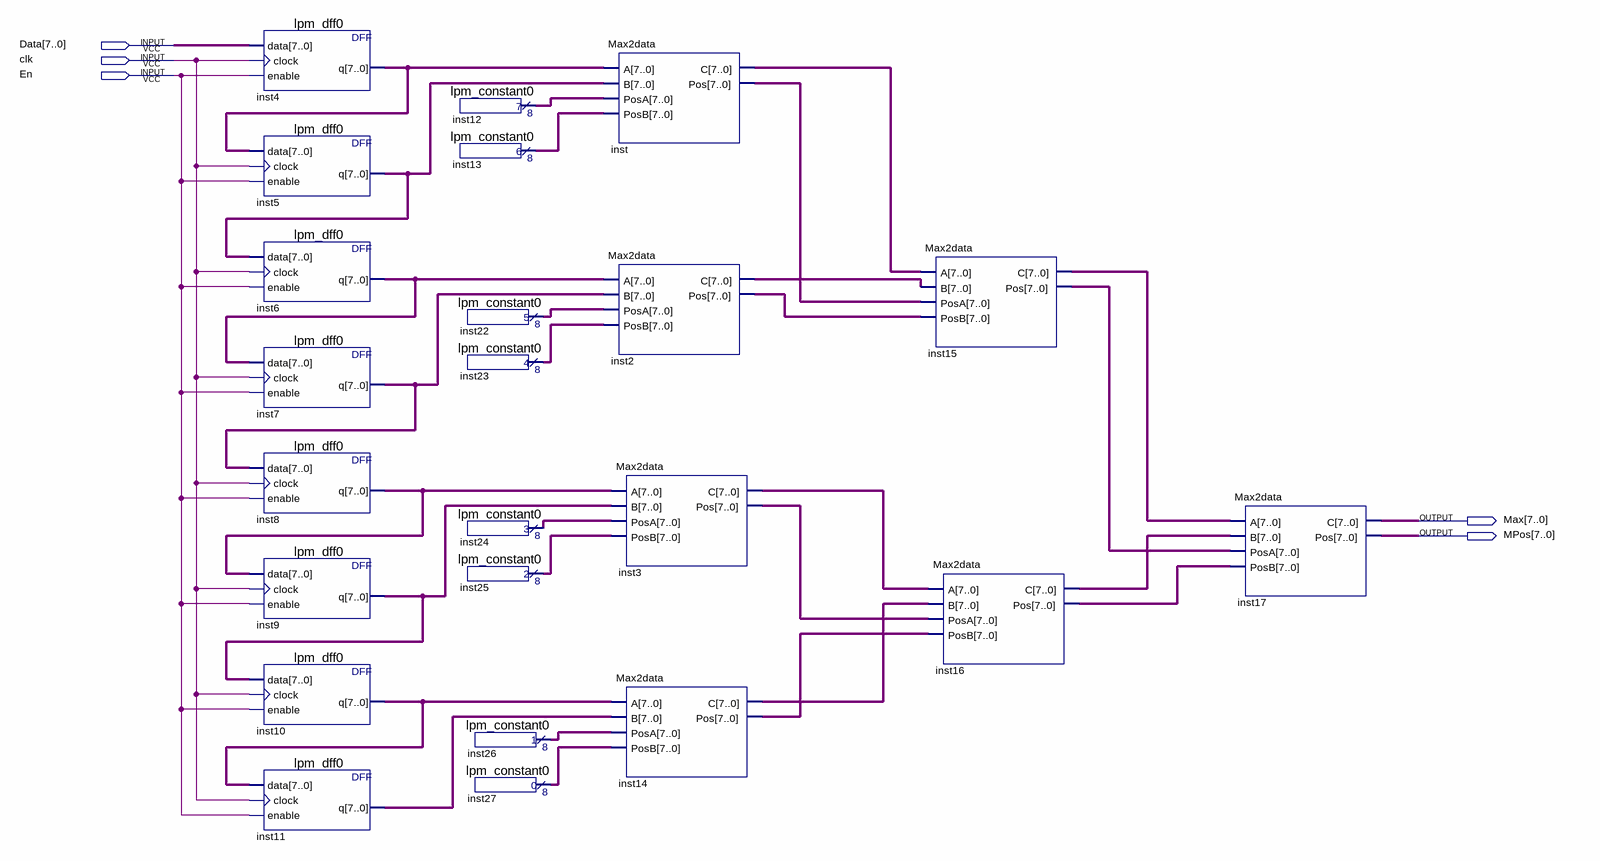
[diagram p0: schematic sheet]
// Quartus schematic 8bit_compare_plus.bdf as structural Verilog: 23 symbols, 5 pins
module \8bit_compare_plus  (
  input  [7:0] Data,
  input  clk,
  input  En,
  output [7:0] Max,
  output [7:0] MPos
);

  wire [7:0] inst2_c, inst2_pos, inst3_c, inst3_pos, inst4_q, inst5_q, inst6_q, inst7_q, inst8_q, inst9_q,
       inst10_q, inst11_q, inst12_result, inst13_result, inst14_c, inst14_pos, inst15_c, inst15_pos,
       inst16_c, inst16_pos, inst22_result, inst23_result, inst24_result, inst25_result, inst26_result,
       inst27_result, inst_c, inst_pos;

  lpm_dff0 inst4 (.data(Data), .clock(clk), .enable(En), .q(inst4_q));
  lpm_dff0 inst5 (.data(inst4_q), .clock(clk), .enable(En), .q(inst5_q));
  lpm_dff0 inst6 (.data(inst5_q), .clock(clk), .enable(En), .q(inst6_q));
  lpm_dff0 inst7 (.data(inst6_q), .clock(clk), .enable(En), .q(inst7_q));
  lpm_dff0 inst8 (.data(inst7_q), .clock(clk), .enable(En), .q(inst8_q));
  lpm_dff0 inst9 (.data(inst8_q), .clock(clk), .enable(En), .q(inst9_q));
  lpm_dff0 inst10 (.data(inst9_q), .clock(clk), .enable(En), .q(inst10_q));
  lpm_dff0 inst11 (.data(inst10_q), .clock(clk), .enable(En), .q(inst11_q));
  lpm_constant0 inst12 (.result(inst12_result));
  lpm_constant0 inst13 (.result(inst13_result));
  lpm_constant0 inst22 (.result(inst22_result));
  lpm_constant0 inst23 (.result(inst23_result));
  lpm_constant0 inst24 (.result(inst24_result));
  lpm_constant0 inst25 (.result(inst25_result));
  lpm_constant0 inst26 (.result(inst26_result));
  lpm_constant0 inst27 (.result(inst27_result));
  Max2data inst (.A(inst4_q), .B(inst5_q), .PosA(inst12_result), .PosB(inst13_result), .C(inst_c), .Pos(inst_pos));
  Max2data inst2 (.A(inst6_q), .B(inst7_q), .PosA(inst22_result), .PosB(inst23_result), .C(inst2_c), .Pos(inst2_pos));
  Max2data inst3 (.A(inst8_q), .B(inst9_q), .PosA(inst24_result), .PosB(inst25_result), .C(inst3_c), .Pos(inst3_pos));
  Max2data inst14 (
    .A(inst10_q), .B(inst11_q), .PosA(inst26_result), .PosB(inst27_result), .C(inst14_c), .Pos(inst14_pos));
  Max2data inst15 (.A(inst_c), .B(inst2_c), .PosA(inst_pos), .PosB(inst2_pos), .C(inst15_c), .Pos(inst15_pos));
  Max2data inst16 (.A(inst3_c), .B(inst14_c), .PosA(inst3_pos), .PosB(inst14_pos), .C(inst16_c), .Pos(inst16_pos));
  Max2data inst17 (.A(inst15_c), .B(inst16_c), .PosA(inst15_pos), .PosB(inst16_pos), .C(Max), .Pos(MPos));
endmodule
